# Altium schematic sheet Digit.SchDoc: Single Nixie digit
size A4; Author: L. Sartory; Organization: L. Sartory; Address2: Nixie clock; Address3: with GPS synchronization; DocumentNumber: 3; Revision: B1; SheetNumber: 3; SheetTotal: 12
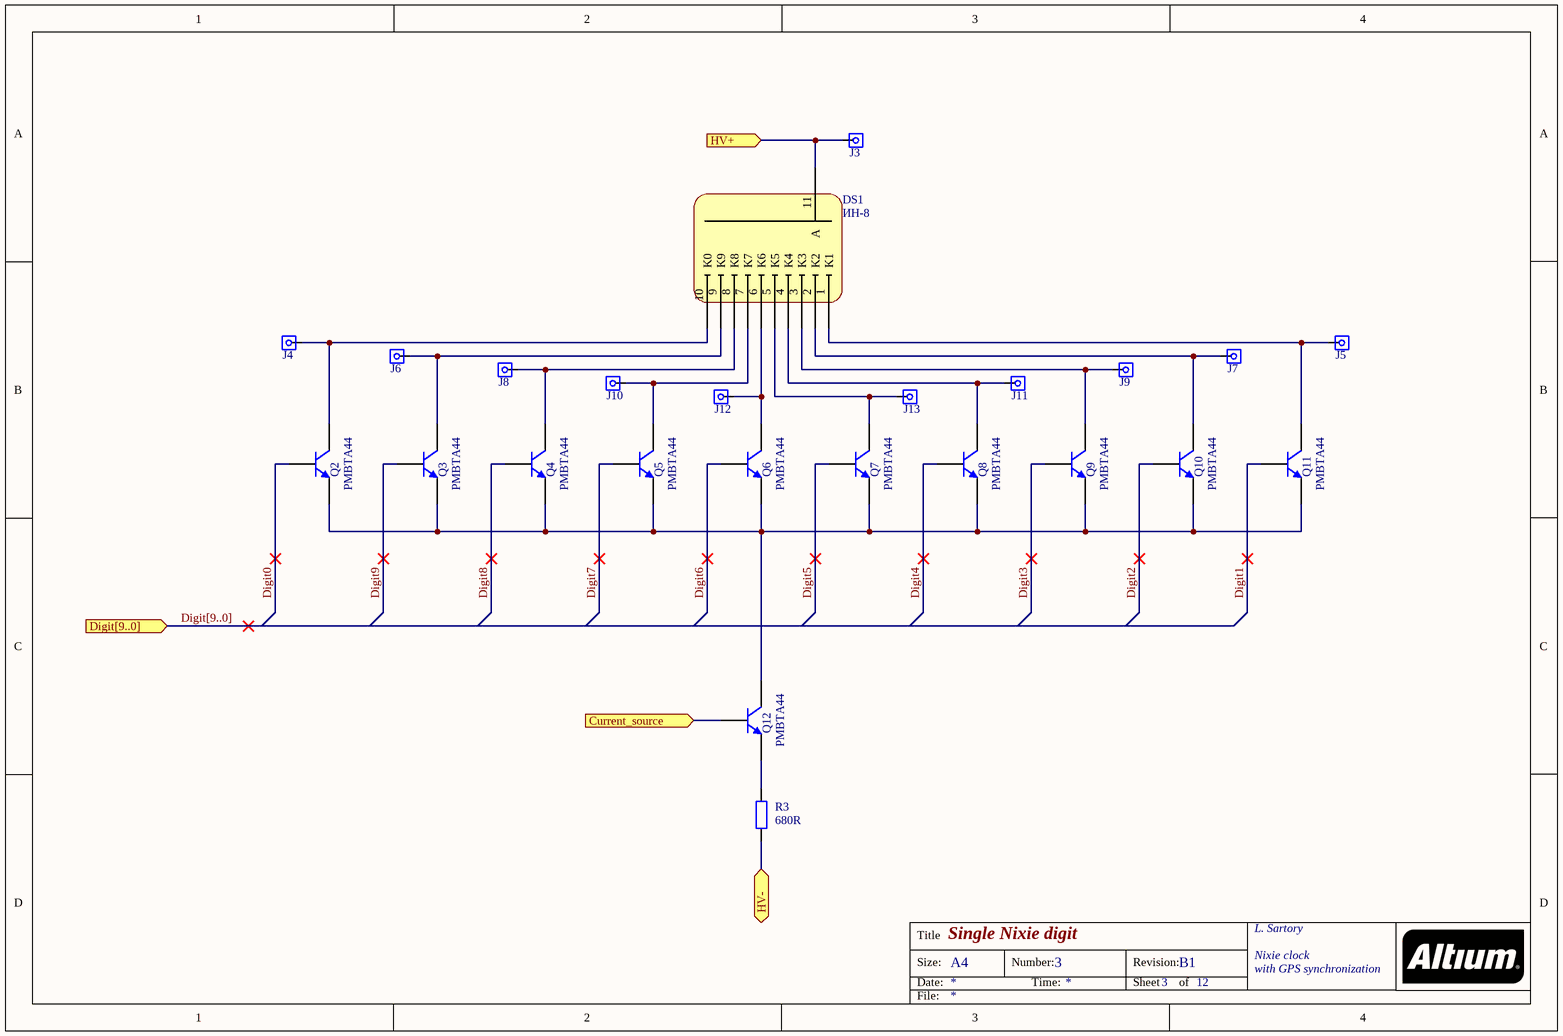
[diagram p0: Digit.SchDoc]

## Parts
DS1  ИН-8  [IN-8]
J3  TE_5645518-1  [TE_5645518-1]  (value not drawn)
J4  TE_5645518-1  [TE_5645518-1]  (value not drawn)
J5  TE_5645518-1  [TE_5645518-1]  (value not drawn)
J6  TE_5645518-1  [TE_5645518-1]  (value not drawn)
J7  TE_5645518-1  [TE_5645518-1]  (value not drawn)
J8  TE_5645518-1  [TE_5645518-1]  (value not drawn)
J9  TE_5645518-1  [TE_5645518-1]  (value not drawn)
J10  TE_5645518-1  [TE_5645518-1]  (value not drawn)
J11  TE_5645518-1  [TE_5645518-1]  (value not drawn)
J12  TE_5645518-1  [TE_5645518-1]  (value not drawn)
J13  TE_5645518-1  [TE_5645518-1]  (value not drawn)
Q2  PMBTA44  [SOT23_PMBTA44]
Q3  PMBTA44  [SOT23_PMBTA44]
Q4  PMBTA44  [SOT23_PMBTA44]
Q5  PMBTA44  [SOT23_PMBTA44]
Q6  PMBTA44  [SOT23_PMBTA44]
Q7  PMBTA44  [SOT23_PMBTA44]
Q8  PMBTA44  [SOT23_PMBTA44]
Q9  PMBTA44  [SOT23_PMBTA44]
Q10  PMBTA44  [SOT23_PMBTA44]
Q11  PMBTA44  [SOT23_PMBTA44]
Q12  PMBTA44  [SOT23_PMBTA44]
R3  680R  [RES0805]

## Ports
Current_source (in), Digit[9..0] (in), HV+ (in), HV- (bidir)

## Nets
Current_source: Q12.1(B) ; port Current_source
Digit0: Q2.1(B)
Digit1: Q11.1(B)
Digit2: Q10.1(B)
Digit3: Q9.1(B)
Digit4: Q8.1(B)
Digit5: Q7.1(B)
Digit6: Q6.1(B)
Digit7: Q5.1(B)
Digit8: Q4.1(B)
Digit9: Q3.1(B)
HV+: DS1.11(A) J3.1 ; port HV+
HV-: R3.1 ; port HV-
NetDS1_1: DS1.1(K1) J5.1 Q11.3(C)
NetDS1_2: DS1.2(K2) J7.1 Q10.3(C)
NetDS1_3: DS1.3(K3) J9.1 Q9.3(C)
NetDS1_4: DS1.4(K4) J11.1 Q8.3(C)
NetDS1_5: DS1.5(K5) J13.1 Q7.3(C)
NetDS1_6: DS1.6(K6) J12.1 Q6.3(C)
NetDS1_7: DS1.7(K7) J10.1 Q5.3(C)
NetDS1_8: DS1.8(K8) J8.1 Q4.3(C)
NetDS1_9: DS1.9(K9) J6.1 Q3.3(C)
NetDS1_10: DS1.10(K0) J4.1 Q2.3(C)
NetQ2_2: Q2.2(E) Q3.2(E) Q4.2(E) Q5.2(E) Q6.2(E) Q7.2(E) Q8.2(E) Q9.2(E) Q10.2(E) Q11.2(E) Q12.3(C)
NetQ12_2: Q12.2(E) R3.2

## Buses and harness runs
bus Digit[9..0] = port Digit[9..0]

## Notes on the sheet
- Title
- Size:
- Date:
- A4
- Number:
- Time:
- Revision:
- Sheet
- of
- File:
- (in symbol 680R 0805) Text

## Library data of the parts
DS1 = ИН-8: Nixie tube
J3-J13 = TE_5645518-1: Mini-spring socket
Q2-Q12 = PMBTA44: 400 V, 0.3 A NPN high-voltage low VCEsat transistor; HelpURL: http://assets.nexperia.com/documents/data-sheet/PMBTA44.pdf
R3 = 680R 0805: Chip resistor 680R 0805; Value: 680R